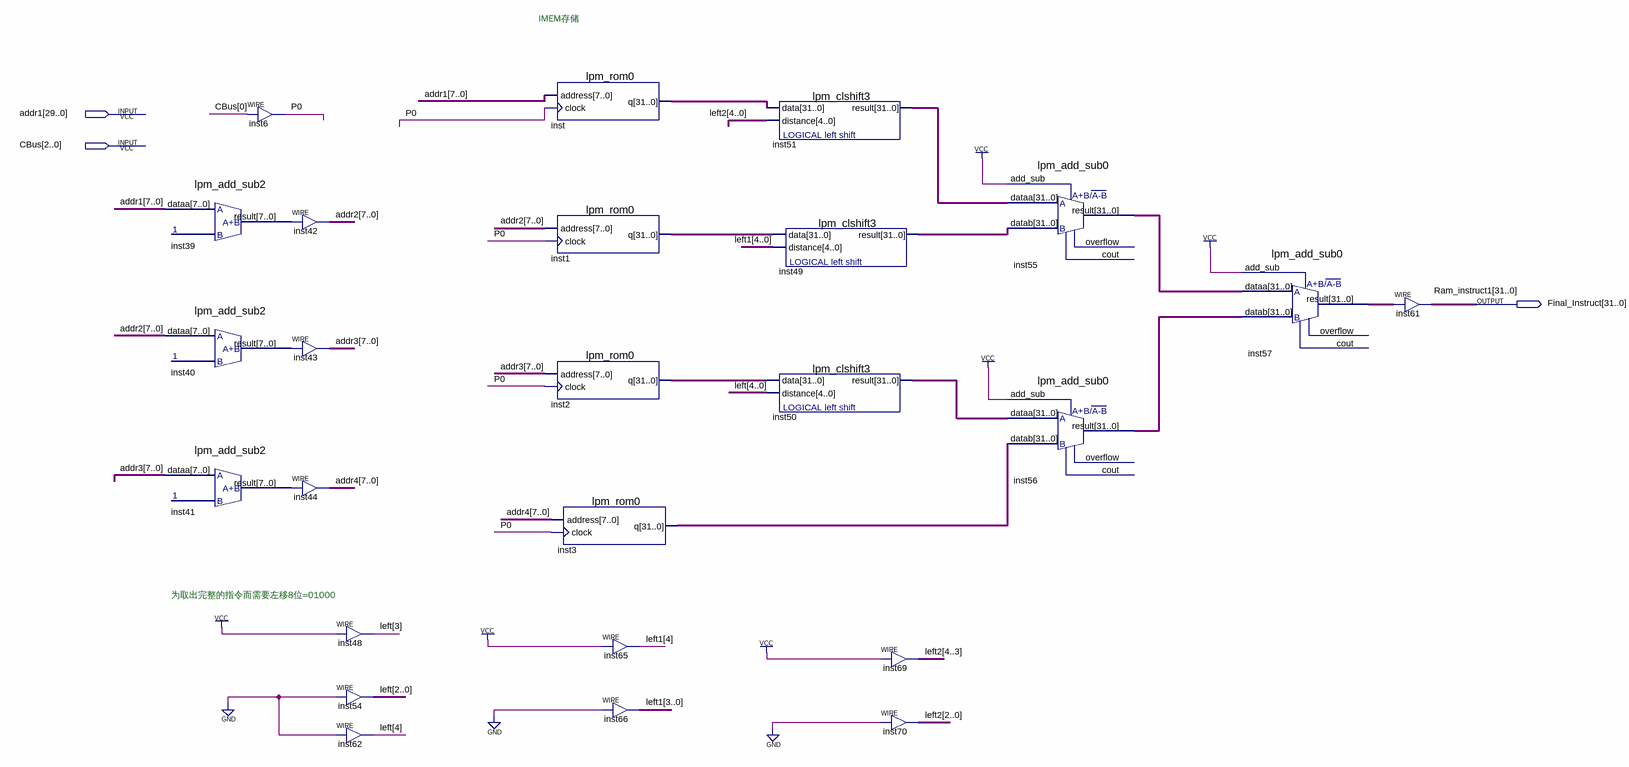
[diagram p0: schematic sheet]
// Quartus schematic IMEM.bdf as structural Verilog: 25 symbols, 3 pins
module IMEM (
  input  [29:0] addr1,
  input  [2:0] CBus,
  output [31:0] Final_Instruct
);

  wire P0;
  wire [4:0] left, left1, left2;
  wire [7:0] addr2, addr3, addr4, inst39_result, inst40_result, inst41_result;
  wire [31:0] inst1_q, inst2_q, inst3_q, inst49_result, inst50_result, inst51_result, inst55_result,
       inst56_result, inst57_result, inst_q;

  lpm_add_sub2 inst39 (.dataa(addr1[7:0]), .result(inst39_result));
  lpm_add_sub2 inst40 (.dataa(addr2), .result(inst40_result));
  lpm_add_sub2 inst41 (.dataa(addr3), .result(inst41_result));
  assign P0 = CBus[0];  // WIRE inst6
  assign addr2 = inst39_result;  // WIRE inst42
  assign addr3 = inst40_result;  // WIRE inst43
  assign addr4 = inst41_result;  // WIRE inst44
  assign left[3] = 1'b1;  // WIRE inst48
  assign left[2:0] = 3'b000;  // WIRE inst54
  assign left[4] = 1'b0;  // WIRE inst62
  lpm_rom0 inst (.address(addr1[7:0]), .clock(P0), .q(inst_q));
  lpm_rom0 inst1 (.address(addr2), .clock(P0), .q(inst1_q));
  lpm_rom0 inst2 (.address(addr3), .clock(P0), .q(inst2_q));
  lpm_rom0 inst3 (.address(addr4), .clock(P0), .q(inst3_q));
  assign left1[4] = 1'b1;  // WIRE inst65
  assign left1[3:0] = 4'b0000;  // WIRE inst66
  lpm_clshift3 inst51 (.data(inst_q), .distance(left2), .result(inst51_result));
  lpm_clshift3 inst49 (.data(inst1_q), .distance(left1), .result(inst49_result));
  lpm_clshift3 inst50 (.data(inst2_q), .distance(left), .result(inst50_result));
  assign left2[4:3] = 2'b11;  // WIRE inst69
  assign left2[2:0] = 3'b000;  // WIRE inst70
  lpm_add_sub0 inst55 (
    .dataa(inst51_result), .datab(inst49_result), .add_sub(1'b1), .result(inst55_result));  // open: overflow, cout
  lpm_add_sub0 inst56 (
    .dataa(inst50_result), .datab(inst3_q), .add_sub(1'b1), .result(inst56_result));  // open: overflow, cout
  lpm_add_sub0 inst57 (
    .dataa(inst55_result), .datab(inst56_result), .add_sub(1'b1), .result(inst57_result));  // open: overflow, cout
  assign Final_Instruct = inst57_result;  // WIRE inst61

  // Other names for the same wires on the sheet: Ram_instruct1[31:0] = Final_Instruct

  // Notes on the sheet:
  //   IMEM存储
  //   为取出完整的指令而需要左移8位=01000
endmodule
